# EAGLE schematic DifferentialAmp (EAGLE 9.6.2)
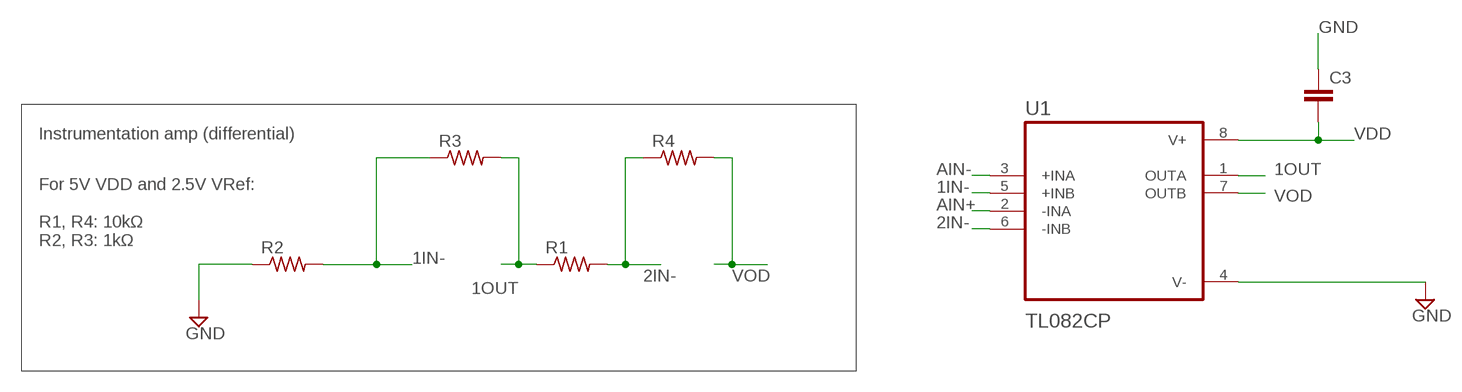
[diagram p0: schematic, sheet 1]

## Parts
C3  C2.5/2  [C2.5-2]
R1  R-US_0204/5  [0204/5]
R2  R-US_0204/5  [0204/5]
R3  R-US_0204/5  [0204/5]
R4  R-US_0204/5  [0204/5]
U1  TL082CP  [DIP794W45P254L959H508Q8]

## Nets
1IN-: R2.2 R3.1 U1.5(+INB)
1OUT: R1.1 R3.2 U1.1(OUTA)
2IN-: R1.2 R4.1 U1.6(-INB)
AIN+: U1.2(-INA)
AIN-: U1.3(+INA)
GND: C3.1 R2.1
N$14: U1.8(V+)
N$15: U1.4(V-)
VDD: C3.2
VOD: R4.2 U1.7(OUTB)

## Notes on the sheet
- Instrumentation amp (differential)
- For 5V VDD and 2.5V VRef:
  
  R1, R4: 10kΩ
  R2, R3: 1kΩ

## Library data of the parts
C3 = capacitor-wima:C: CAPACITOR naming: grid - package width
R1-R4 = rcl:R-US_: RESISTOR, American symbol; SPICEPREFIX: R
U1 = TL082CP:TL082CP: Check availability <https://pricing.snapeda.com/parts/TL082CP/Texas%20Instruments/view-part?ref=eda>; AVAILABILITY: In Stock; CHECK_PRICES: https://www.snapeda.com/parts/TL082CP/Texas+Instruments/view-part/?ref=eda; DESCRIPTION: Dual, 30-V, 3-MHz, 13-V/µs slew rate, In to V+, JFET-input op amp; MF: Texas Instruments; MP: TL082CP; PACKAGE: PDIP-8 Texas; PRICE: None; PURCHASE-URL: https://www.snapeda.com/api/url_track_click_mouser/?unipart_id=854431&manufacturer=Texas Instruments&part_name=TL082CP&search_term=tl082; SNAPEDA_LINK: https://www.snapeda.com/parts/TL082CP/Texas+Instruments/view-part/?ref=snap